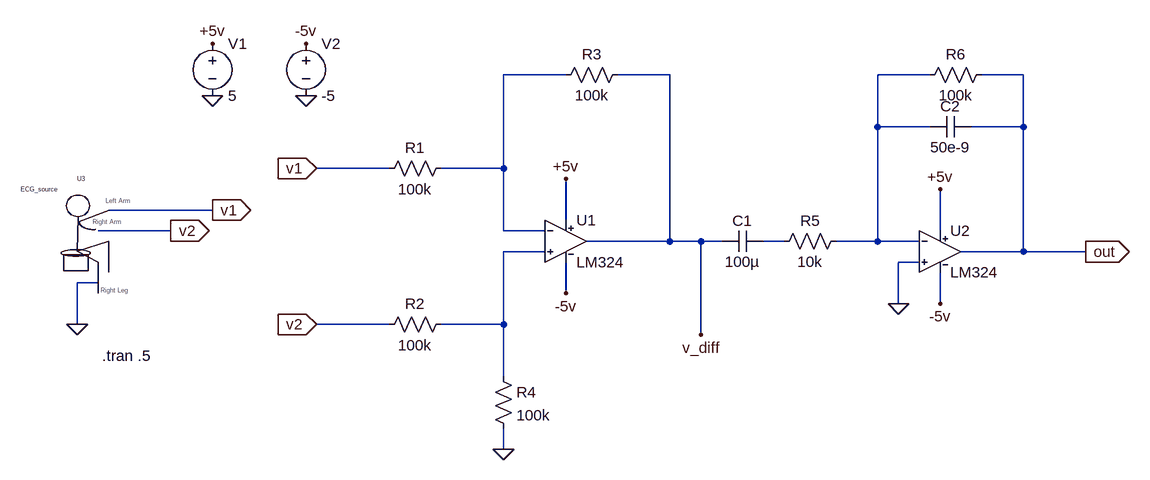
[diagram p0: schematic exp2.asc]
exp2.asc, the LTspice schematic file:
Version 4
SHEET 1 976 680
WIRE 80 -128 -16 -128
WIRE 240 -128 160 -128
WIRE 640 -128 560 -128
WIRE 784 -128 720 -128
WIRE 560 -48 560 -128
WIRE 640 -48 560 -48
WIRE 784 -48 784 -128
WIRE 784 -48 704 -48
WIRE -192 16 -304 16
WIRE -16 16 -16 -128
WIRE -16 16 -112 16
WIRE -464 80 -624 80
WIRE 80 96 80 32
WIRE -528 112 -640 112
WIRE -16 112 -16 16
WIRE 48 112 -16 112
WIRE 656 112 656 48
WIRE 240 128 240 -128
WIRE 240 128 112 128
WIRE 288 128 240 128
WIRE 320 128 288 128
WIRE 416 128 384 128
WIRE 560 128 560 -48
WIRE 560 128 496 128
WIRE 624 128 560 128
WIRE 48 144 -16 144
WIRE 784 144 784 -48
WIRE 784 144 688 144
WIRE 880 144 784 144
WIRE 624 160 592 160
WIRE -640 192 -672 192
WIRE 80 208 80 160
WIRE 592 224 592 160
WIRE 656 224 656 176
WIRE -672 256 -672 192
WIRE -192 256 -304 256
WIRE -16 256 -16 144
WIRE -16 256 -112 256
WIRE 288 272 288 128
WIRE -16 336 -16 256
WIRE -16 448 -16 416
FLAG -464 -96 0
FLAG -320 -96 0
FLAG -464 -176 +5v
FLAG -320 -176 -5v
FLAG -304 256 v2
IOPIN -304 256 In
FLAG 80 32 +5v
FLAG 80 208 -5v
FLAG -16 448 0
FLAG 592 224 0
FLAG 656 48 +5v
FLAG 656 224 -5v
FLAG 880 144 out
IOPIN 880 144 Out
FLAG -672 256 0
FLAG -464 80 v1
IOPIN -464 80 Out
FLAG -528 112 v2
IOPIN -528 112 Out
FLAG -304 16 v1
IOPIN -304 16 In
FLAG 288 272 v_diff
SYMBOL LM324 80 64 R0
SYMATTR InstName U1
SYMBOL LM324 656 80 R0
SYMATTR InstName U2
SYMBOL voltage -464 -192 R0
WINDOW 123 0 0 Left 0
WINDOW 39 0 0 Left 0
SYMATTR InstName V1
SYMATTR Value 5
SYMBOL voltage -320 -192 R0
WINDOW 123 0 0 Left 0
WINDOW 39 0 0 Left 0
SYMATTR InstName V2
SYMATTR Value -5
SYMBOL res -96 0 R90
WINDOW 0 0 56 VBottom 2
WINDOW 3 32 56 VTop 2
SYMATTR InstName R1
SYMATTR Value 100k
SYMBOL res -96 240 R90
WINDOW 0 0 56 VBottom 2
WINDOW 3 32 56 VTop 2
SYMATTR InstName R2
SYMATTR Value 100k
SYMBOL res 176 -144 R90
WINDOW 0 0 56 VBottom 2
WINDOW 3 32 56 VTop 2
SYMATTR InstName R3
SYMATTR Value 100k
SYMBOL res -32 320 R0
SYMATTR InstName R4
SYMATTR Value 100k
SYMBOL cap 384 112 R90
WINDOW 0 0 32 VBottom 2
WINDOW 3 32 32 VTop 2
SYMATTR InstName C1
SYMATTR Value 100µ
SYMBOL res 512 112 R90
WINDOW 0 0 56 VBottom 2
WINDOW 3 32 56 VTop 2
SYMATTR InstName R5
SYMATTR Value 10k
SYMBOL res 736 -144 R90
WINDOW 0 0 56 VBottom 2
WINDOW 3 32 56 VTop 2
SYMATTR InstName R6
SYMATTR Value 100k
SYMBOL cap 704 -64 R90
WINDOW 0 0 32 VBottom 2
WINDOW 3 32 32 VTop 2
SYMATTR InstName C2
SYMATTR Value 50e-9
SYMBOL human -672 128 R0
SYMATTR InstName U3
TEXT -634 304 Left 2 !.tran .5

The netlist it stands for:
* exp2.asc
XU1 N004 N001 +5v -5v v_diff LM324  ; pins In+ In- V+ V- OUT
XU2 0 N002 +5v -5v out LM324  ; pins In+ In- V+ V- OUT
V1 +5v 0 5
V2 -5v 0 -5
R1 N001 v1 100k
R2 N004 v2 100k
R3 v_diff N001 100k
R4 N004 0 100k
C1 N003 v_diff 100µ
R5 N002 N003 10k
R6 out N002 100k
C2 out N002 50e-9
XU3 v1 v2 0 ECG_source  ; pins LA RA RL
.tran .5
.lib LM324.lib
.lib human.sub
.backanno
.end